# EAGLE schematic meteo-slave (EAGLE 9.0.0)
DELETE: MF

## Sheet 1 of 2
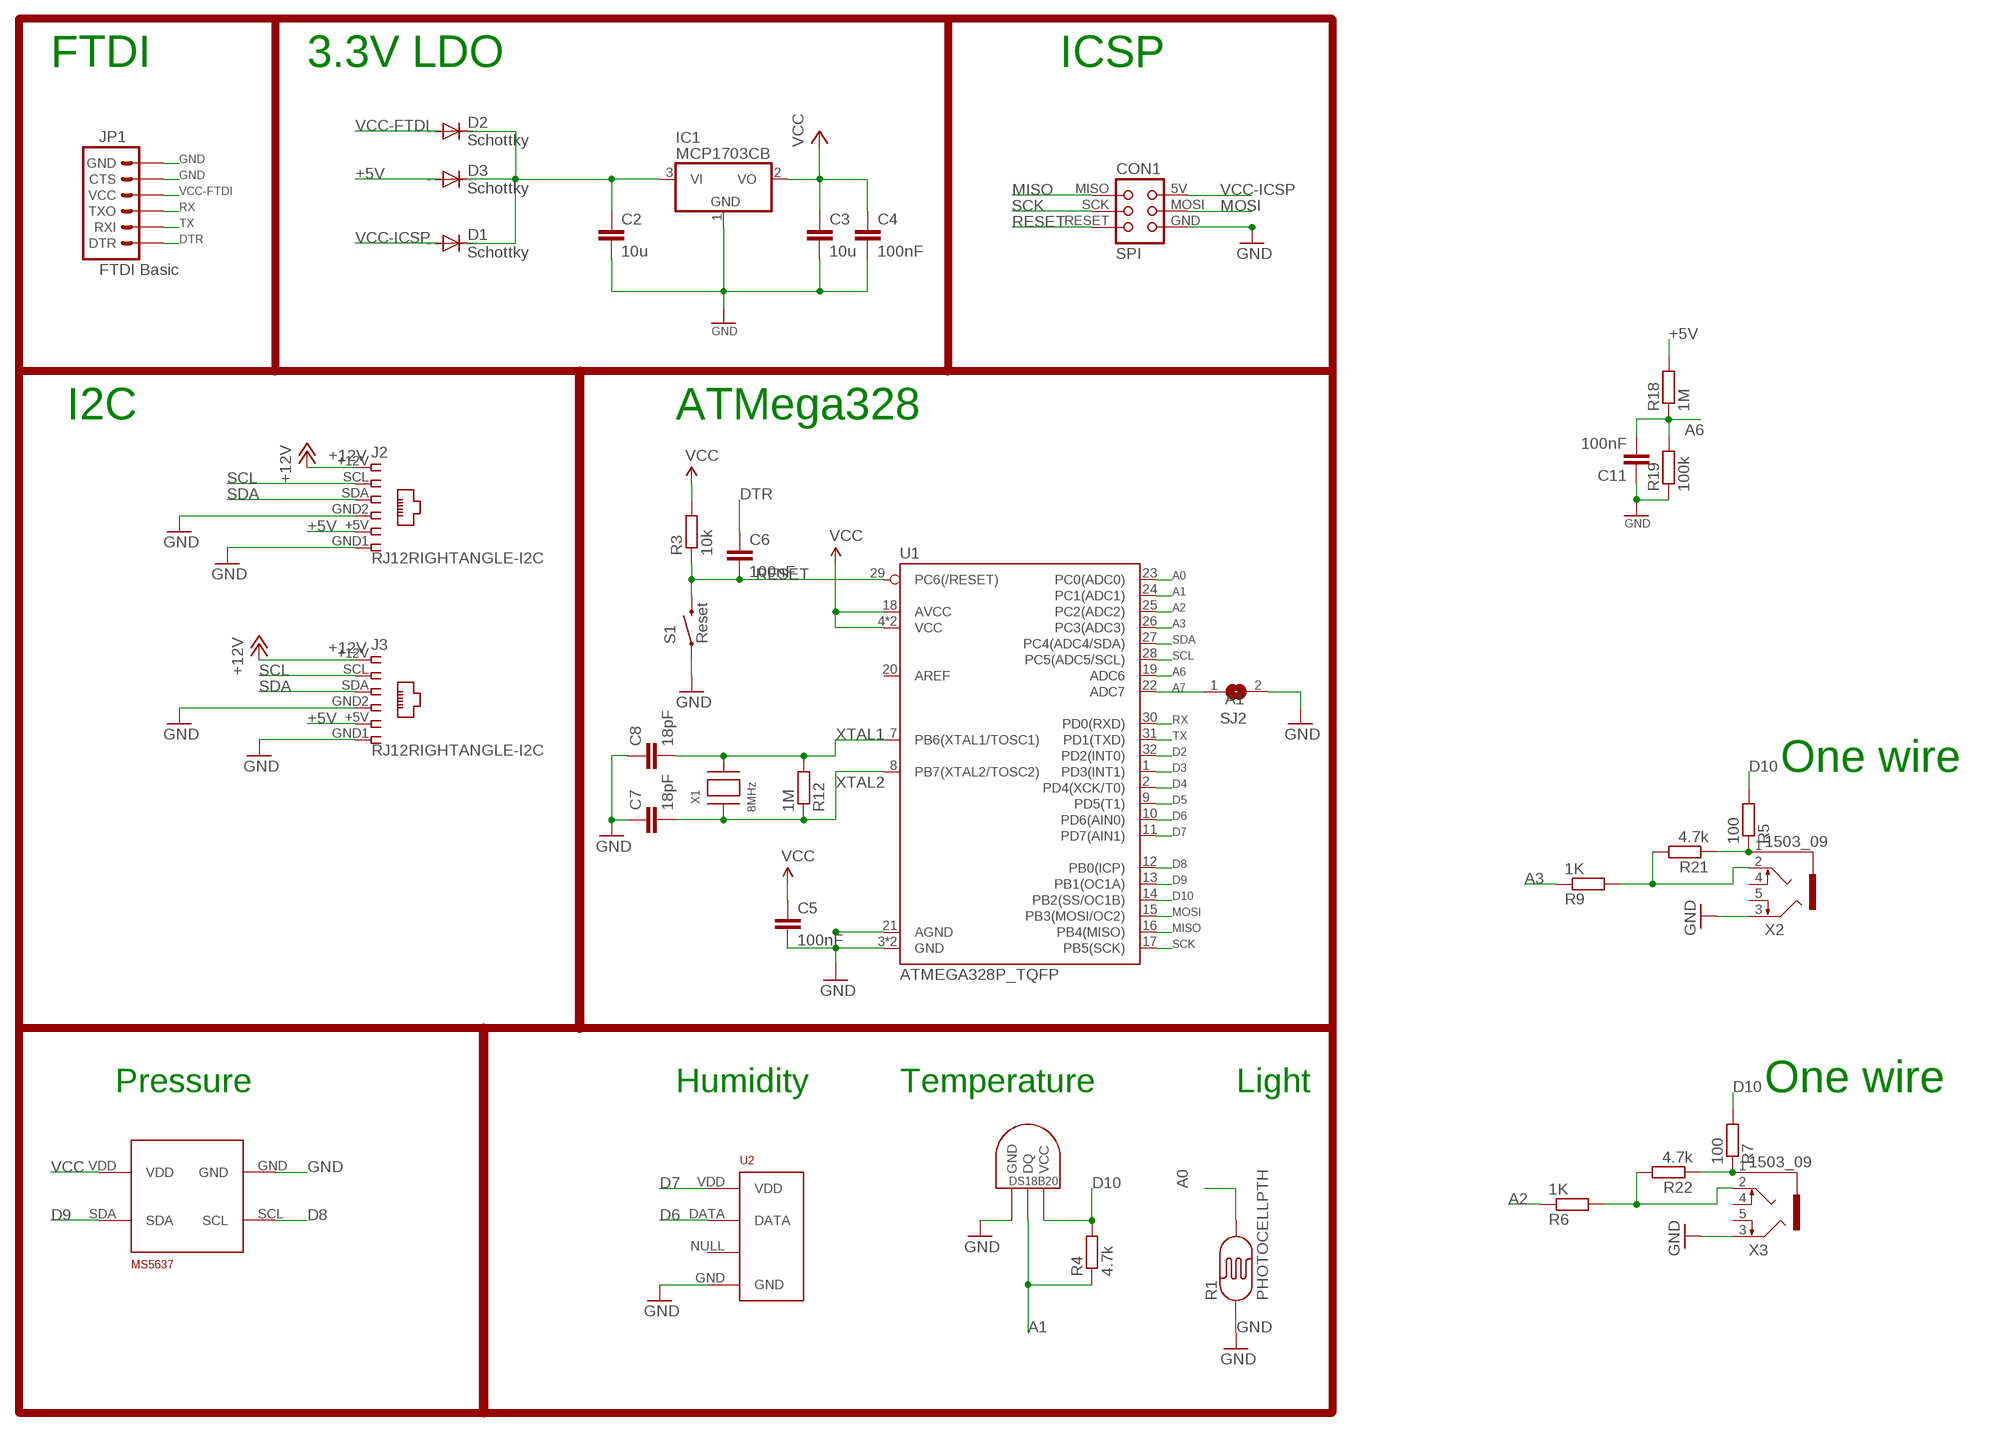
[diagram p0: schematic, sheet 1]

### Parts
C2  10u  C-EUC0805K  [C0805K]
C3  10u  C-EUC0805K  [C0805K]
C4  100nF  C-EUC0805K  [C0805K]
C5  100nF  C-EUC0805K  [C0805K]
C6  100nF  C-EUC0805K  [C0805K]
C7  18pF  C-EUC0805K  [C0805K]
C8  18pF  C-EUC0805K  [C0805K]
C11  100nF  C-EUC0805K  [C0805K]
CON1  SPI  TINYISPTAG  [TC2030-MCP]
D1  Schottky  MBR0520LT  [SOD123]
D2  Schottky  MBR0520LT  [SOD123]
D3  Schottky  MBR0520LT  [SOD123]
IC1  MCP1703CB  [SOT23]
J2  RJ12RIGHTANGLE-I2C  [RJ12-RIGHTANGLE-I2C]
J3  RJ12RIGHTANGLE-I2C  [RJ12-RIGHTANGLE-I2C]
JP1  FTDI Basic  ARDUINO_SERIAL_PROGRAMPTH  [1X06]
R1  PHOTOCELLPTH  [PHOTOCELL]
R3  10k  R-EU_R0805  [R0805]
R4  4.7k  R-EU_R0805  [R0805]
R5  100  R-EU_R0805  [R0805]
R6  1K  R-EU_R0805  [R0805]
R7  100  R-EU_R0805  [R0805]
R9  1K  R-EU_R0805  [R0805]
R12  1M  R-EU_R0805  [R0805]
R18  1M  R-EU_R0805  [R0805]
R19  100k  R-EU_R0805  [R0805]
R21  4.7k  R-EU_R0805  [R0805]
R22  4.7k  R-EU_R0805  [R0805]
S1  Reset  SWITCH-MOMENTARY-2SMD-ALT01  [TACTILE-SWITCH-SMD-ALT01]
SJ2  A1  SJ  [SJ]
U1  ATMEGA328P_TQFP  [TQFP32-08]
U2  RHT03_DHT-22_AM2302  [RHT03_DHT-22]
U$1  DS1820TO92  [DS1820]
U$19  MS5637WIDE  [MS5637WIDE]
X1  8MHz  XTALNX6035  [NX6035]
X2  1503_09  [1503_09]
X3  1503_09  [1503_09]

### Nets
+5V: D3.A J2.+5V J3.+5V R18.2
+12V [power]: J2.+12V J3.+12V
+XV: C2.1 D1.C D2.C D3.C IC1.3(VI)
A0: R1.2 U1.23(PC0(ADC0))
A1: R4.1 U1.24(PC1(ADC1)) U$1.DQ
A2: R6.1 U1.25(PC2(ADC2))
A3: R9.1 U1.26(PC3(ADC3))
A6: C11.2 R18.1 R19.2 U1.19(ADC6)
A7: SJ2.1 U1.22(ADC7)
D2: U1.32(PD2(INT0))
D3: U1.1(PD3(INT1))
D4: U1.2(PD4(XCK/T0))
D5: U1.9(PD5(T1))
D6: U1.10(PD6(AIN0)) U2.DATA
D7: U1.11(PD7(AIN1)) U2.VDD
D8: U1.12(PB0(ICP)) U$19.SCL
D9: U1.13(PB1(OC1A)) U$19.SDA
D10: R4.2 R5.2 R7.2 U1.14(PB2(SS/OC1B)) U$1.VDD(VCC)
DTR: C6.1 JP1.1(DTR)
GND [power]: C2.2 C3.2 C4.2 C5.2 C7.1 C8.1 C11.1 CON1.GND IC1.1(GND) J2.GND1 J2.GND2 J3.GND1 J3.GND2 JP1.5(CTS) JP1.6(GND) R1.1 R19.1 S1.1 S1.2 SJ2.2 U1.3(GND) U1.5(GND) U1.21(AGND) U2.GND U$1.GND U$19.GND X2.3 X3.3
MISO: CON1.MISO U1.16(PB4(MISO))
MOSI: CON1.MOSI U1.15(PB3(MOSI/OC2))
N$1 [power]: R6.2 R22.2 X3.2
N$2 [power]: R7.1 R22.1 X3.1
N$14 [power]: R5.1 R21.1 X2.1
N$21 [power]: R9.2 R21.2 X2.2
RESET: C6.2 CON1.RESET R3.1 S1.3 S1.4 U1.29(PC6(/RESET))
RX: JP1.3(TXO) U1.30(PD0(RXD))
SCK: CON1.SCK U1.17(PB5(SCK))
SCL: J2.SCL J3.SCL U1.28(PC5(ADC5/SCL))
SDA: J2.SDA J3.SDA U1.27(PC4(ADC4/SDA))
TX: JP1.2(RXI) U1.31(PD1(TXD))
VCC: C3.1 C4.1 C5.1 IC1.2(VO) R3.2 U1.4(VCC) U1.6(VCC) U1.18(AVCC) U$19.VDD
VCC-FTDI: D2.A JP1.4(VCC)
VCC-ICSP: CON1.5V(VCC) D1.A
XTAL1: C8.2 R12.2 U1.7(PB6(XTAL1/TOSC1)) X1.P$2
XTAL2: C7.2 R12.1 U1.8(PB7(XTAL2/TOSC2)) X1.P$1
Unconnected: U1.20(AREF) U2.NULL X2.4 X2.5 X3.4 X3.5

### Notes on the sheet
- FTDI | 3.3V LDO | ICSP
- I2C | ATMega328
- One wire
- Pressure | Humidity | Temperature | Light | One wire

## Sheet 2 of 2

## Library data of the parts
C2 C3 = rcl:C-EU: CAPACITOR, European symbol; ELECROW: C15850; LCSC: C15850; MPN: 77-VJ1206V106ZXQTBC
C4-C6 C11 = rcl:C-EU: CAPACITOR, European symbol; ELECROW: C49678; LCSC: C49678; MPN: 80-C1206C104K5R
C7 C8 = rcl:C-EU: CAPACITOR, European symbol; ELECROW: C1797; LCSC: C1797; MPN: 77-VJ1206A180JXXPBC
CON1 = lpatiny:TINYISP: CONNECTOR
D1-D3 = diode:MBR0520LT: SCHOTTKY BARRIER RECTIFIER Source: http://onsemi.com .. MBR0520LT1-D.pdf; LCSC: C82544; MPN: 621-1N5819HW-F
IC1 = linear:MCP1703: 250 mA, 16V, Low Quiescent Current LDO Regulator Source: http://ww1.microchip.com/downloads/en/DeviceDoc/22049b.pdf; LCSC: C53352
J2 J3 = lpatiny:RJ12: CORCOM Modular RJ Jacks No Shield Source: www.tycoelectronics.com .. ENG_DS_1654001_1099_RJ_L_0507.pdf
JP1 = SparkFun:ARDUINO_SERIAL_PROGRAM
R1 = SparkFun:PHOTOCELL: Photocell Also known as a CdS photoresistor. This is a low cost way to detect light levels. Resistance decreases with more incoming light. SparkFun SKU: SEN-09088
R3 = rcl:R-EU_: RESISTOR, European symbol; ELECROW: C17513; LCSC: C17513
R4 R21 R22 = resistor:R-EU_: RESISTOR, European symbol
R5-R7 R9 = rcl:R-EU_: RESISTOR, European symbol
R12 R18 R19 = rcl:R-EU_: RESISTOR, European symbol; ELECROW: C17514; LCSC: C17514
S1 = Testing:SWITCH-MOMENTARY-2: Various NO switches- pushbuttons, reed, etc
SJ2 = jumper:SJ: SMD solder JUMPER
U1 = SparkFun-IC-Microcontroller:ATMEGA328P_TQFP: Popular 328P in QFP Storefront component: ATmega328 - TQFP <https://www.sparkfun.com/products/13448> (COM-13448) Datasheet <http://www.sparkfun.com/datasheets/Components/SMD/ATMega328.pdf> SparkFun Products SparkFun RedBoard - Programmed with Arduino <https://www.sparkfun.com/products/12757> (DEV-12757) Arduino Pro Mini 328 - 5V/16MHz <https://www.sparkfun.com/products/11113> (DEV-11113) Arduino Pro Mini 328 - 3.3V/8MHz <https://www.sparkfun.com/products/11114> (DEV-11114) SparkFun OpenLog <https://www.sparkfun.com/products/13712> (DEV-13712) SparkFun MicroView - OLED Arduino Module <https://www.sparkfun.com/products/12923> (DEV-12923) SparkFun Digital Sandbox <https://www.sparkfun.com/products/12651> (DEV-12651) SparkFun PicoBoard <https://www.sparkfun.com/products/11888> (WIG-11888) Arduino Fio <https://www.sparkfun.com/products/10116> (DEV-10116) LilyPad Arduino 328 Main Board <https://www.sparkfun.com/products/13342> (DEV-13342) SparkFun RedStick <https://www.sparkfun.com/products/13741> (DEV-13741) LilyPad MP3 <https://www.sparkfun.com/products/11013> (DEV-11013) LilyPad Arduino SimpleSnap <https://www.sparkfun.com/products/10941> (DEV-10941) SparkFun Stepoko <https://www.sparkfun.com/products/13899> (ROB-13899) SparkFun Geiger Counter <https://www.sparkfun.com/products/11345> (SEN-11345) SparkFun EL Sequencer <https://www.sparkfun.com/products/12781> (COM-12781) Arduino Pro 328 - 5V/16MHz <https://www.sparkfun.com/products/10915> (DEV-10915) CryptoCape <https://www.sparkfun.com/products/12773> (DEV-12773) SparkFun IR Thermometer Evaluation Board - MLX90614 <https://www.sparkfun.com/products/10740> (SEN-10740) SparkFun RedBot Mainboard <https://www.sparkfun.com/products/12097> (ROB-12097) Arduino Pro 328 - 3.3V/8MHz <https://www.sparkfun.com/products/10914> (DEV-10914) SparkFun Block for Intel® Edison - Arduino <https://www.sparkfun.com/products/13036> (DEV-13036) SparkFun Simon Says - Surface Mount Soldering Kit <https://www.sparkfun.com/products/10935> (KIT-10935) SparkFun 7-Segment Serial Display - Red <https://www.sparkfun.com/products/11441> (COM-11441) SparkFun 7-Segment Serial Display - White <https://www.sparkfun.com/products/11629> (COM-11629) SparkFun 7-Segment Serial Display - Yellow <https://www.sparkfun.com/products/11443> (COM-11443) SparkFun 7-Segment Serial Display - Kelly Green <https://www.sparkfun.com/products/11440> (COM-11440) SparkFun 7-Segment Serial Display - Blue <https://www.sparkfun.com/products/11442> (COM-11442) SparkFun OpenSegment Serial Display - 20mm (Blue) <https://www.sparkfun.com/products/11647> (COM-11647) SparkFun OpenSegment Serial Display - 20mm (Green) <https://www.sparkfun.com/products/11646> (COM-11646) SparkFun OpenSegment Serial Display - 20mm (White) <https://www.sparkfun.com/products/11648> (COM-11648) SparkFun OpenSegment Serial Display - 20mm (Red) <https://www.sparkfun.com/products/11644> (COM-11644) SparkFun OpenSegment Serial Display - 20mm (Yellow) <https://www.sparkfun.com/products/11645> (COM-11645) SparkFun OpenSegment Shield <https://www.sparkfun.com/products/13190> (DEV-13190); PROD_ID: IC-09069
U2 = RHT03_DHT-22_AM2302:RHT03_DHT-22_AM2302: RHT03 / DHT-22 / AM2302 Packages and symbol for the RHT03 / DHT-22 relative humidity and temperature sensor. Note: The AM2302 is a wired version of the DHT-22 which typically requires less clearance and is thus provided as a separate package.; PROD_ID: SEN-10167
U$1 = Ava:DS1820: DS18B20 Programmable Resolution 1-Wire Digital Thermometer Description The DS18B20 digital thermometer provides 9-bit to 12-bit Celsius temperature measurements and has an alarm function with nonvolatile user-programmable upper and lower trigger points. The DS18B20 communicates over a 1-Wire® bus that by definition requires only one data line (and ground) for communication with a central microprocessor. It has an operating temperature range of -55°C to +125°C and is accurate to ±0.5°C over the range of -10°C to +85°C. In addition, the DS18B20 can derive power directly from the data line ("parasite power"), eliminating the need for an external power supply. Each DS18B20 has a unique 64-bit serial code, which allows multiple DS18B20s to function on the same 1-Wire bus. Thus, it is simple to use one microprocessor to control many DS18B20s distributed over a large area. Applications that can benefit from this feature include HVAC environmental controls, temperature monitoring systems inside buildings, equipment, or machinery, and process monitoring and control systems.
U$19 = MS5637:MS5637: Le MS563702BA03-50 est un Micro Altimètre ultra compact optimisé pour des applications d'altimètre et de baromètre dans des téléphones portables et des tablettes. La résolution d'altitude au niveau de la mer est de 13cm d'air. Le module de capteur comprend un capteur de pression haute linéarité et un CAN ΔΣ 24 bits ultra faible puissance avec des coefficients internes calibrés en usine. Il fournit une valeur numérique de pression et de température précise de 24 bits et différents modes de fonctionnement qui permettent à l'utilisateur d'optimiser la vitesse de conversion et la consommation de courant. La sortie de température à haute résolution permet la mise en œuvre d'une fonction altimètre / thermomètre sans capteur supplémentaire. Il peut être interfacé avec pratiquement tous les microcontrôleurs à interface I²C-bus. Le protocole de communication est simple, sans avoir à programmer des registres internes dans l'appareil. Faibles dimensions de 3 x 3 x 0.9mm³ pour une intégratio Module haute résolution, 13cm Capteur de pression numérique intégré (CAN ΔΣ 24 bits) Interface I²C Plage de pression étendue de 10 à 2000mbar Conversion rapide jusqu'à 0.5ms Faible consommation, 0.6µA (veille <=0.1µA à 25°C) Aucun composant externe (oscillateur interne)
X1 = lpatiny:XTAL: Low cost SMT crystals, no capacitors included http://www.ladyada.net/library/eagle; LCSC: C122522; MPN: 729-F60800010
X2 X3 = con-lumberg:1503_09: Jack connectors according to JISC 6560, 3.5 mm Klinkeneinbaukupplung nach JISC 6560, 3,5 mm, 3-polig/ stereo, abgewinkelte Ausführung, mit 2 Öffnern und Lötaugen, für Leiterplatten Rückseitenmontage Source: http://www.lumberg.com/Produkte/PDFs/1503_09.pdf; OC_FARNELL: 1243244; OC_NEWARK: unknown

## Net classes
0 default: width 0.254 mm, clearance 0.25 mm
1 power: width 0.254 mm, drill 0.305 mm, clearance 0.25 mm
2 VIN: width 0.406 mm, clearance 0.25 mm
3 fine: width 0.406 mm, clearance 0.25 mm
4 aref: width 0.406 mm, clearance 0.25 mm